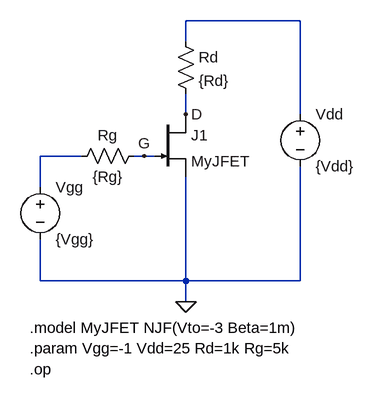
[diagram p0: schematic MyJFET.asc]
MyJFET.asc, the LTspice schematic file:
Version 4
SHEET 1 880 680
WIRE 288 -128 112 -128
WIRE 112 -96 112 -128
WIRE 112 16 112 -16
WIRE 288 16 288 -128
WIRE -48 80 -112 80
WIRE 48 80 32 80
WIRE 64 80 48 80
WIRE -112 128 -112 80
WIRE -112 272 -112 208
WIRE 112 272 112 112
WIRE 112 272 -112 272
WIRE 288 272 288 96
WIRE 288 272 112 272
WIRE 112 304 112 272
FLAG 112 304 0
FLAG 112 16 D
FLAG 48 80 G
SYMBOL njf 64 16 R0
SYMATTR InstName J1
SYMATTR Value MyJFET
SYMBOL voltage 288 0 R0
SYMATTR InstName Vdd
SYMATTR Value {Vdd}
SYMBOL voltage -112 112 R0
SYMATTR InstName Vgg
SYMATTR Value {Vgg}
SYMBOL res 96 -112 R0
SYMATTR InstName Rd
SYMATTR Value {Rd}
SYMBOL res 48 64 R90
WINDOW 0 0 56 VBottom 2
WINDOW 3 32 56 VTop 2
SYMATTR InstName Rg
SYMATTR Value {Rg}
TEXT -128 344 Left 2 !.model MyJFET NJF(Vto=-3 Beta=1m)
TEXT -128 376 Left 2 !.param Vgg=-1 Vdd=25 Rd=1k Rg=5k
TEXT -128 408 Left 2 !.op

The netlist it stands for:
* MyJFET.asc
J1 D G 0 MyJFET
Vdd N001 0 {Vdd}
Vgg N002 0 {Vgg}
Rd N001 D {Rd}
Rg G N002 {Rg}
.model NJF NJF
.model PJF PJF
.lib standard.jft
.model MyJFET NJF(Vto=-3 Beta=1m)
.param Vgg=-1 Vdd=25 Rd=1k Rg=5k
.op
.backanno
.end